# Altium schematic sheet Merge_ESC_Board.SchDoc
size A3; SheetNumber: 1; SheetTotal: 2
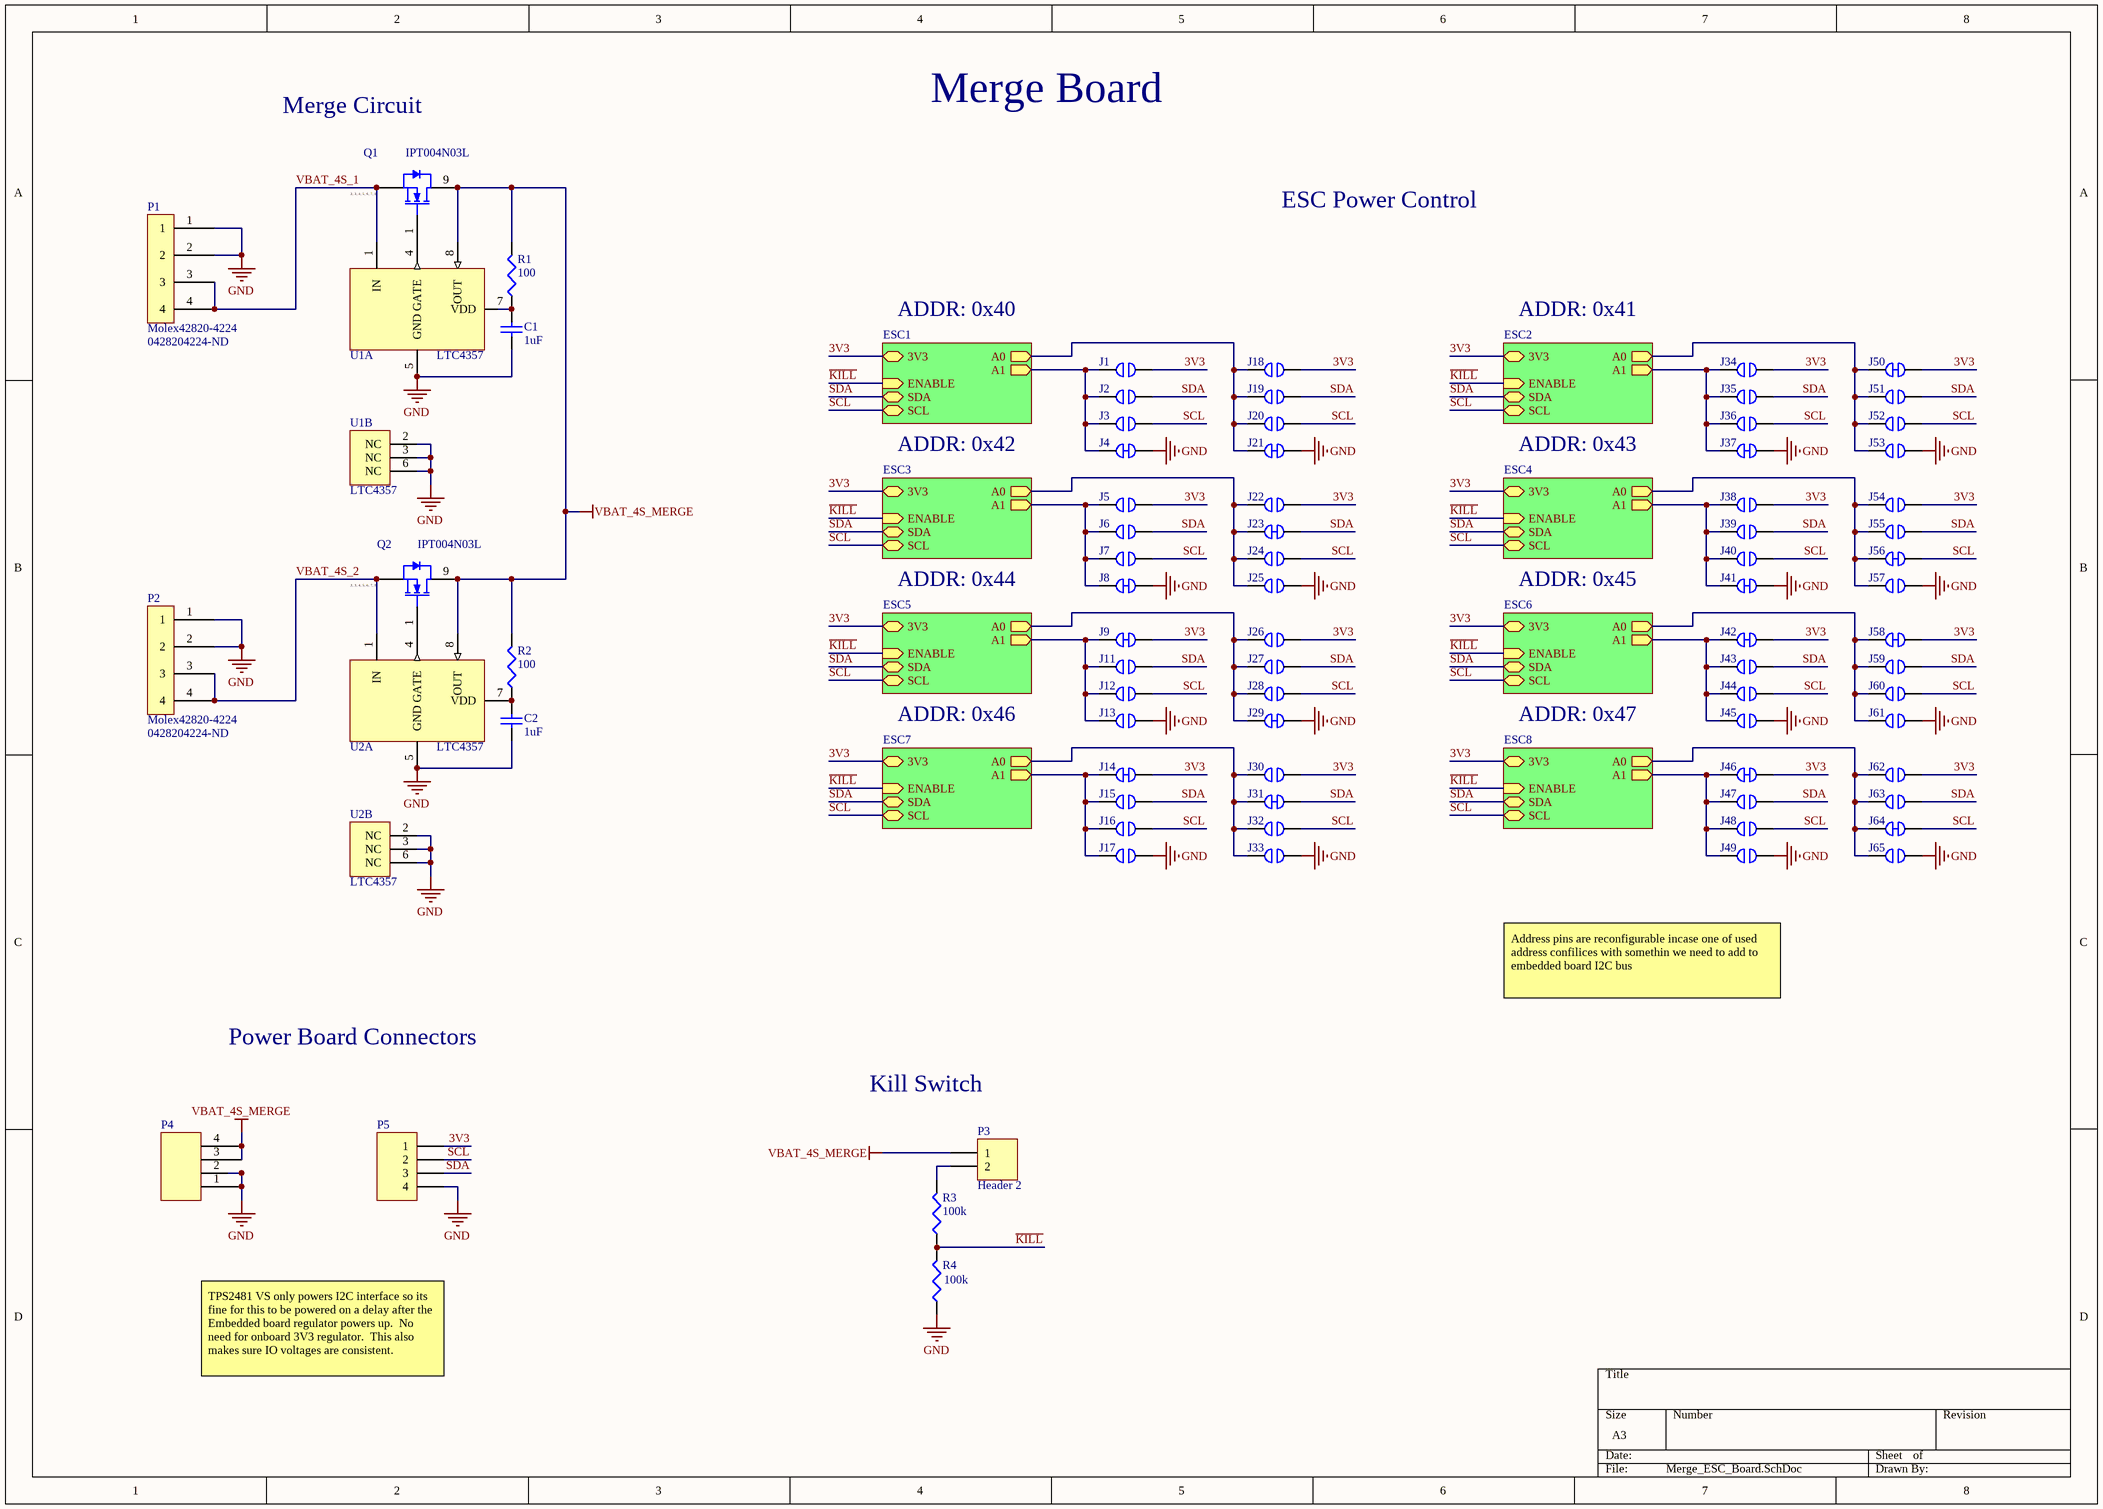
[diagram p0: Merge_ESC_Board.SchDoc]

## Parts
C1  value 1uF  [C1206]  (hidden comment: Cap Semi)
C2  value 1uF  [C1206]  (hidden comment: Cap Semi)
J1  JumperOpen  [JUMPER_OPEN]  (value not drawn)  (net tie, no BOM)
J2  JumperOpen  [JUMPER_OPEN]  (value not drawn)  (net tie, no BOM)
J3  JumperOpen  [JUMPER_OPEN]  (value not drawn)  (net tie, no BOM)
J4  JumperShorted  [JUMPER_SHORT]  (value not drawn)  (net tie, no BOM)
J5  JumperOpen  [JUMPER_OPEN]  (value not drawn)  (net tie, no BOM)
J6  JumperOpen  [JUMPER_OPEN]  (value not drawn)  (net tie, no BOM)
J7  JumperOpen  [JUMPER_OPEN]  (value not drawn)  (net tie, no BOM)
J8  JumperShorted  [JUMPER_SHORT]  (value not drawn)  (net tie, no BOM)
J9  JumperShorted  [JUMPER_SHORT]  (value not drawn)  (net tie, no BOM)
J11  JumperOpen  [JUMPER_OPEN]  (value not drawn)  (net tie, no BOM)
J12  JumperOpen  [JUMPER_OPEN]  (value not drawn)  (net tie, no BOM)
J13  JumperOpen  [JUMPER_OPEN]  (value not drawn)  (net tie, no BOM)
J14  JumperShorted  [JUMPER_SHORT]  (value not drawn)  (net tie, no BOM)
J15  JumperOpen  [JUMPER_OPEN]  (value not drawn)  (net tie, no BOM)
J16  JumperOpen  [JUMPER_OPEN]  (value not drawn)  (net tie, no BOM)
J17  JumperOpen  [JUMPER_OPEN]  (value not drawn)  (net tie, no BOM)
J18  JumperOpen  [JUMPER_OPEN]  (value not drawn)  (net tie, no BOM)
J19  JumperOpen  [JUMPER_OPEN]  (value not drawn)  (net tie, no BOM)
J20  JumperOpen  [JUMPER_OPEN]  (value not drawn)  (net tie, no BOM)
J21  JumperShorted  [JUMPER_SHORT]  (value not drawn)  (net tie, no BOM)
J22  JumperOpen  [JUMPER_OPEN]  (value not drawn)  (net tie, no BOM)
J23  JumperShorted  [JUMPER_SHORT]  (value not drawn)  (net tie, no BOM)
J24  JumperOpen  [JUMPER_OPEN]  (value not drawn)  (net tie, no BOM)
J25  JumperOpen  [JUMPER_OPEN]  (value not drawn)  (net tie, no BOM)
J26  JumperOpen  [JUMPER_OPEN]  (value not drawn)  (net tie, no BOM)
J27  JumperOpen  [JUMPER_OPEN]  (value not drawn)  (net tie, no BOM)
J28  JumperOpen  [JUMPER_OPEN]  (value not drawn)  (net tie, no BOM)
J29  JumperShorted  [JUMPER_SHORT]  (value not drawn)  (net tie, no BOM)
J30  JumperOpen  [JUMPER_OPEN]  (value not drawn)  (net tie, no BOM)
J31  JumperShorted  [JUMPER_SHORT]  (value not drawn)  (net tie, no BOM)
J32  JumperOpen  [JUMPER_OPEN]  (value not drawn)  (net tie, no BOM)
J33  JumperOpen  [JUMPER_OPEN]  (value not drawn)  (net tie, no BOM)
J34  JumperOpen  [JUMPER_OPEN]  (value not drawn)  (net tie, no BOM)
J35  JumperOpen  [JUMPER_OPEN]  (value not drawn)  (net tie, no BOM)
J36  JumperOpen  [JUMPER_OPEN]  (value not drawn)  (net tie, no BOM)
J37  JumperShorted  [JUMPER_SHORT]  (value not drawn)  (net tie, no BOM)
J38  JumperOpen  [JUMPER_OPEN]  (value not drawn)  (net tie, no BOM)
J39  JumperOpen  [JUMPER_OPEN]  (value not drawn)  (net tie, no BOM)
J40  JumperOpen  [JUMPER_OPEN]  (value not drawn)  (net tie, no BOM)
J41  JumperShorted  [JUMPER_SHORT]  (value not drawn)  (net tie, no BOM)
J42  JumperShorted  [JUMPER_SHORT]  (value not drawn)  (net tie, no BOM)
J43  JumperOpen  [JUMPER_OPEN]  (value not drawn)  (net tie, no BOM)
J44  JumperOpen  [JUMPER_OPEN]  (value not drawn)  (net tie, no BOM)
J45  JumperOpen  [JUMPER_OPEN]  (value not drawn)  (net tie, no BOM)
J46  JumperShorted  [JUMPER_SHORT]  (value not drawn)  (net tie, no BOM)
J47  JumperOpen  [JUMPER_OPEN]  (value not drawn)  (net tie, no BOM)
J48  JumperOpen  [JUMPER_OPEN]  (value not drawn)  (net tie, no BOM)
J49  JumperOpen  [JUMPER_OPEN]  (value not drawn)  (net tie, no BOM)
J50  JumperShorted  [JUMPER_SHORT]  (value not drawn)  (net tie, no BOM)
J51  JumperOpen  [JUMPER_OPEN]  (value not drawn)  (net tie, no BOM)
J52  JumperOpen  [JUMPER_OPEN]  (value not drawn)  (net tie, no BOM)
J53  JumperOpen  [JUMPER_OPEN]  (value not drawn)  (net tie, no BOM)
J54  JumperOpen  [JUMPER_OPEN]  (value not drawn)  (net tie, no BOM)
J55  JumperOpen  [JUMPER_OPEN]  (value not drawn)  (net tie, no BOM)
J56  JumperShorted  [JUMPER_SHORT]  (value not drawn)  (net tie, no BOM)
J57  JumperOpen  [JUMPER_OPEN]  (value not drawn)  (net tie, no BOM)
J58  JumperShorted  [JUMPER_SHORT]  (value not drawn)  (net tie, no BOM)
J59  JumperOpen  [JUMPER_OPEN]  (value not drawn)  (net tie, no BOM)
J60  JumperOpen  [JUMPER_OPEN]  (value not drawn)  (net tie, no BOM)
J61  JumperOpen  [JUMPER_OPEN]  (value not drawn)  (net tie, no BOM)
J62  JumperOpen  [JUMPER_OPEN]  (value not drawn)  (net tie, no BOM)
J63  JumperOpen  [JUMPER_OPEN]  (value not drawn)  (net tie, no BOM)
J64  JumperShorted  [JUMPER_SHORT]  (value not drawn)  (net tie, no BOM)
J65  JumperOpen  [JUMPER_OPEN]  (value not drawn)  (net tie, no BOM)
P1  Molex42820-4224  Supplier Part Number 1: 0428204224-ND  [Molex42820-4224]
P2  Molex42820-4224  Supplier Part Number 1: 0428204224-ND  [Molex42820-4224]
P3  Header 2  [HDR1X2]
P4  200241-1114  [Molex2002411114]  (value not drawn)
P5  Header 4  [DF13-4P-1.25DSA]  (value not drawn)
Q1  IPT004N03L  [INF-PG-HSOF-8-1_V]
Q2  IPT004N03L  [INF-PG-HSOF-8-1_V]
R1  value 100  [J1-0603]  (hidden comment: Res3)
R2  value 100  [J1-0603]  (hidden comment: Res3)
R3  value 100k  [J1-0603]  (hidden comment: Res3)
R4  value 100k  [J1-0603]  (hidden comment: Res3)
U1  LTC4357  [LT-MS8-8_N]  (parts A,B of 2)
U2  LTC4357  [LT-MS8-8_N]  (parts A,B of 2)

## Sub-sheets
ESC1 = ESC_Header.SchDoc: 3V3 (bidir), SCL (bidir), SDA (bidir), ENABLE (in), A1 (out), A0 (out)
ESC2 = ESC_Header.SchDoc: 3V3 (bidir), SCL (bidir), SDA (bidir), ENABLE (in), A1 (out), A0 (out)
ESC3 = ESC_Header.SchDoc: 3V3 (bidir), SCL (bidir), SDA (bidir), ENABLE (in), A1 (out), A0 (out)
ESC4 = ESC_Header.SchDoc: 3V3 (bidir), SCL (bidir), SDA (bidir), ENABLE (in), A1 (out), A0 (out)
ESC5 = ESC_Header.SchDoc: 3V3 (bidir), SCL (bidir), SDA (bidir), ENABLE (in), A1 (out), A0 (out)
ESC6 = ESC_Header.SchDoc: 3V3 (bidir), SCL (bidir), SDA (bidir), ENABLE (in), A1 (out), A0 (out)
ESC7 = ESC_Header.SchDoc: 3V3 (bidir), SCL (bidir), SDA (bidir), ENABLE (in), A1 (out), A0 (out)
ESC8 = ESC_Header.SchDoc: 3V3 (bidir), SCL (bidir), SDA (bidir), ENABLE (in), A1 (out), A0 (out)

## Nets
GND: C1.1 C2.1 J4.2 J8.2 J13.2 J17.2 J21.2 J25.2 J29.2 J33.2 J37.2 J41.2 J45.2 J49.2 J53.2 J57.2 J61.2 J65.2 P1.1 P1.2 P2.1 P2.2 P4.1 P4.2 P5.4 R4.1 U1.2(NC) U1.3(NC) U1.5(GND) U1.6(NC) U2.2(NC) U2.3(NC) U2.5(GND) U2.6(NC)
VBAT_4S_MERGE: P3.1 P4.3 P4.4 Q1.9(D) Q2.9(D) R1.2 R2.2 U1.8(OUT) U2.8(OUT)
3V3: J1.2 J5.2 J9.2 J14.2 J18.2 J22.2 J26.2 J30.2 J34.2 J38.2 J42.2 J46.2 J50.2 J54.2 J58.2 J62.2 P5.1 ; sheet ESC1/3V3, sheet ESC3/3V3, sheet ESC5/3V3, sheet ESC7/3V3, sheet ESC2/3V3, sheet ESC4/3V3, sheet ESC6/3V3, sheet ESC8/3V3
~{KILL}: R3.1 R4.2 ; sheet ESC1/ENABLE, sheet ESC3/ENABLE, sheet ESC5/ENABLE, sheet ESC7/ENABLE, sheet ESC2/ENABLE, sheet ESC4/ENABLE, sheet ESC6/ENABLE, sheet ESC8/ENABLE
SCL: J3.2 J7.2 J12.2 J16.2 J20.2 J24.2 J28.2 J32.2 J36.2 J40.2 J44.2 J48.2 J52.2 J56.2 J60.2 J64.2 P5.2 ; sheet ESC1/SCL, sheet ESC3/SCL, sheet ESC5/SCL, sheet ESC7/SCL, sheet ESC2/SCL, sheet ESC4/SCL, sheet ESC6/SCL, sheet ESC8/SCL
SDA: J2.2 J6.2 J11.2 J15.2 J19.2 J23.2 J27.2 J31.2 J35.2 J39.2 J43.2 J47.2 J51.2 J55.2 J59.2 J63.2 P5.3 ; sheet ESC1/SDA, sheet ESC3/SDA, sheet ESC5/SDA, sheet ESC7/SDA, sheet ESC2/SDA, sheet ESC4/SDA, sheet ESC6/SDA, sheet ESC8/SDA
VBAT_4S_1: P1.3 P1.4 Q1.2(S) Q1.3(S) Q1.4(S) Q1.5(S) Q1.6(S) Q1.7(S) Q1.8(S) U1.1(IN)
VBAT_4S_2: P2.3 P2.4 Q2.2(S) Q2.3(S) Q2.4(S) Q2.5(S) Q2.6(S) Q2.7(S) Q2.8(S) U2.1(IN)
NetC1_2: C1.2 R1.1 U1.7(VDD)
NetC2_2: C2.2 R2.1 U2.7(VDD)
NetJ1_1: J1.1 J2.1 J3.1 J4.1 ; sheet ESC1/A1
NetJ5_1: J5.1 J6.1 J7.1 J8.1 ; sheet ESC3/A1
NetJ9_1: J9.1 J11.1 J12.1 J13.1 ; sheet ESC5/A1
NetJ14_1: J14.1 J15.1 J16.1 J17.1 ; sheet ESC7/A1
NetJ18_1: J18.1 J19.1 J20.1 J21.1 ; sheet ESC1/A0
NetJ22_1: J22.1 J23.1 J24.1 J25.1 ; sheet ESC3/A0
NetJ26_1: J26.1 J27.1 J28.1 J29.1 ; sheet ESC5/A0
NetJ30_1: J30.1 J31.1 J32.1 J33.1 ; sheet ESC7/A0
NetJ34_1: J34.1 J35.1 J36.1 J37.1 ; sheet ESC2/A1
NetJ38_1: J38.1 J39.1 J40.1 J41.1 ; sheet ESC4/A1
NetJ42_1: J42.1 J43.1 J44.1 J45.1 ; sheet ESC6/A1
NetJ46_1: J46.1 J47.1 J48.1 J49.1 ; sheet ESC8/A1
NetJ50_1: J50.1 J51.1 J52.1 J53.1 ; sheet ESC2/A0
NetJ54_1: J54.1 J55.1 J56.1 J57.1 ; sheet ESC4/A0
NetJ58_1: J58.1 J59.1 J60.1 J61.1 ; sheet ESC6/A0
NetJ62_1: J62.1 J63.1 J64.1 J65.1 ; sheet ESC8/A0
NetP3_2: P3.2 R3.2
NetQ1_1: Q1.1(GATE) U1.4(GATE)
NetQ2_1: Q2.1(GATE) U2.4(GATE)

## Notes on the sheet
- Merge Board
- Merge Circuit
- ESC Power Control
- ADDR: 0x40
- ADDR: 0x41
- ADDR: 0x42
- ADDR: 0x43
- ADDR: 0x44
- ADDR: 0x45
- ADDR: 0x46
- ADDR: 0x47
- Address pins are reconfigurable incase one of used address confilices with somethin we need to add to embedded board I2C bus
- Power Board Connectors
- Kill Switch
- TPS2481 VS only powers I2C interface so its fine for this to be powered on a delay after the Embedded board regulator powers up.  No need for onboard 3V3 regulator.  This also makes sure IO voltages are consistent.
- (in symbol IPT004N03L) 2, 3, 4, 5, 6, 7, 8

## Library data of the parts
C1 C2 = Cap Semi: Capacitor (Semiconductor SIM Model); Published: 8-Jun-2000; LatestRevisionDate: 29-May-2009; LatestRevisionNote: IPC-7351 Footprint Added.; PackageReference: C1206; Publisher: Altium Limited; PackageDescription: Chip Capacitor
J1-J3 J5-J7 J11-J13 J15-J20 J22 J24-J28 J30 J32-J36 J38-J40 J43-J45 J47-J49 J51-J55 J57 J59-J63 J65 = JumperOpen: Jumper (Default Open)
J4 J8 J9 J14 J21 J23 J29 J31 J37 J41 J42 J46 J50 J56 J58 J64 = JumperShorted: Jumper (Default Shorted)
P3 = Header 2: Header, 2-Pin; LatestRevisionDate: 17-Jul-2002; LatestRevisionNote: Re-released for DXP Platform.; Publisher: Altium Limited
P4 = Molex2002411114
P5 = Header 4: Header, 4-Pin; LatestRevisionDate: 17-Jul-2002; LatestRevisionNote: Re-released for DXP Platform.; Publisher: Altium Limited
Q1 Q2 = IPT004N03L: N-Channel OptiMOS(TM) Power-MOSFET, 30 V VDS, 300 A ID, -55 to 175 degC, PG-HSOF-8, Reel, Green; Manufacturer: Infineon; Green: TRUE; ID (max): 300 A; IDpuls (max): 1,200 A; Polarity: FALSE; Ptot (max): 300 W; QG: 122 nC; RDS (on) (max): 0.4 mOhm; RthJA (max): 40 K/W; RthJC (max): 0.5 K/W; VDS (max): 30 V; VGS(th) (max): 2.2 V; VGS(th) (min): 0.7 V; DatasheetVersion: Rev. 1.2; PackageVersion: Rev. 04; PackageReference: PG-HSOF-8-1; PackageDescription: 8-Pin Plastic (Green) Heatlink Small Outline Flat Leads Package, 10.375 x 9.9 mm Body, 0.8 mm Pitch; Supplier 1: Mouser; Supplier Part Number 1: N/A; Halogen-free: TRUE; Packing: Reel; Technology: OptiMOS(TM); Mounting Technology: Surface Mount; PartNumber: IPT004N03L; ComponentLink1Description: Manufacturer URL; ComponentLink1URL: http://www.infineon.com/; ComponentLink2Description: Datasheet; ComponentLink2URL: http://www.infineon.com/dgdl/IPT004N03L_rev1.2.pdf?folderId=db3a304313b8b5a60113cee8763b02d7&fileId=db3a30433e9d5d11013e9e0f382600c2; ComponentLink3Description: Package Specification; ComponentLink3URL: http://www.infineon.com/cms/packages/SMD_-_Surface_Mounted_Devices/P-PG-HSOF/P-PG-HSOF-08-1.html?__locale=en
R1-R4 = Res3: Resistor; Published: 8-Jun-2000; LatestRevisionDate: 29-May-2009; LatestRevisionNote: IPC-7351 Footprint Added.; PackageReference: J1-0603; Publisher: Altium Limited; PackageDescription: Chip Resistor
U1 U2 = LTC4357CMS8#PBF: Positive High Voltage Ideal Diode Controller, 9 to 80 V Vin, 8-pin SOP (MS8-8), 0 to 70 degC, Pb-Free; Manufacturer: Linear Technology; Ideal Diode: Single, External, N-Channel; DatasheetVersion: Rev. D; PackageVersion: Rev. G, 03/2012; PackageReference: MS8-8; PackageDescription: 8-Pin Plastic MSOP, Body 3 x 3 mm, Pitch 0.65 mm; Supplier 1: Digi-Key; Supplier Part Number 1: LTC4357CMS8#PBF-ND; Supplier 2: Farnell; Supplier Part Number 2: 1432779; Supplier 3: Newark; Supplier Part Number 3: 56M9468; RoHS: TRUE; Mounting Technology: Surface Mount; PartNumber: LTC4357CMS8#PBF; ComponentLink1Description: Manufacturer URL; ComponentLink1URL: http://www.linear.com/; ComponentLink2Description: Datasheet; ComponentLink2URL: http://cds.linear.com/docs/en/datasheet/4357fd.pdf; ComponentLink3Description: Package Specification; ComponentLink3URL: http://cds.linear.com/docs/en/packaging/05081660_G_MS8.pdf
P1 P2 = Molex42820-4224: Supplier 1: Digi-Key; ComponentLink1Description: DataSheet; ComponentLink1URL: https://www.molex.com/pdm_docs/sd/428204224_sd.pdf